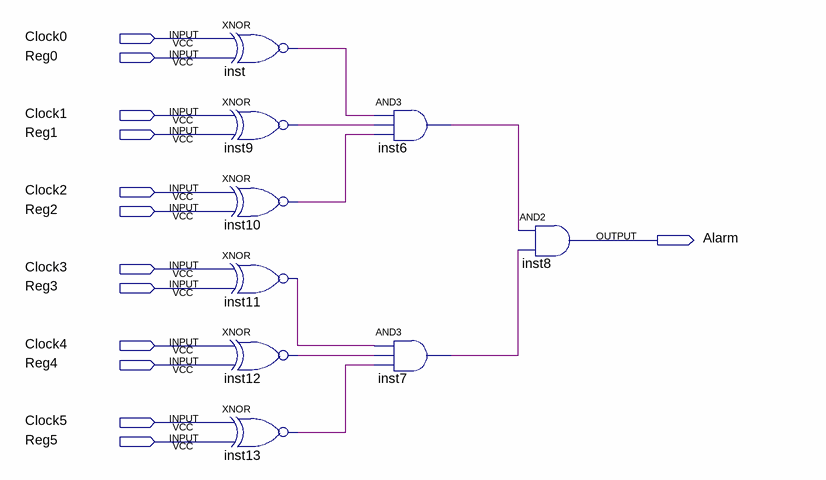
[diagram p0: schematic sheet]
// Quartus schematic alarmmin.bdf as structural Verilog: 9 symbols, 13 pins
module alarmmin (
  input  Clock0,
  input  Reg0,
  input  Clock1,
  input  Reg1,
  input  Clock2,
  input  Reg2,
  input  Clock3,
  input  Reg3,
  input  Clock4,
  input  Reg4,
  input  Clock5,
  input  Reg5,
  output Alarm
);

  wire inst6_out, inst7_out, inst9_out, inst10_out, inst11_out, inst12_out, inst13_out, inst_out;

  xnor inst (inst_out, Clock0, Reg0);
  xnor inst9 (inst9_out, Clock1, Reg1);
  xnor inst10 (inst10_out, Clock2, Reg2);
  xnor inst11 (inst11_out, Clock3, Reg3);
  xnor inst12 (inst12_out, Clock4, Reg4);
  xnor inst13 (inst13_out, Clock5, Reg5);
  and inst6 (inst6_out, inst_out, inst9_out, inst10_out);
  and inst7 (inst7_out, inst11_out, inst12_out, inst13_out);
  and inst8 (Alarm, inst6_out, inst7_out);
endmodule
